# Altium schematic sheet Key.SchDoc
size A4
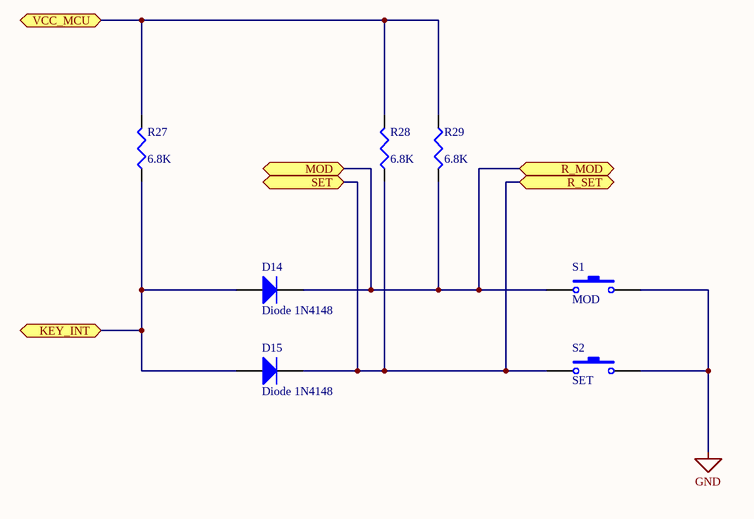
[diagram p0: Key.SchDoc]

## Parts
D14  Diode 1N4148  [DO-41]
D15  Diode 1N4148  [DO-41]
R27  value 6.8K  [12Z-2010]  (hidden comment: Res3)
R28  value 6.8K  [12Z-2010]  (hidden comment: Res3)
R29  value 6.8K  [12Z-2010]  (hidden comment: Res3)
S1  MOD  [SPST-2]
S2  SET  [SPST-2]

## Ports
KEY_INT (bidir), MOD (bidir), R_MOD (bidir), R_SET (bidir), SET (bidir), VCC_MCU (bidir)

## Nets
GND: S1.2 S2.2
KEY_INT: D14.1(A) D15.1(A) R27.1 ; port KEY_INT
MOD: D14.2(K) R29.2 S1.1 ; port MOD, port R_MOD
R_SET: D15.2(K) R28.1 S2.1 ; port SET, port R_SET
VCC_MCU: R27.2 R28.2 R29.1 ; port VCC_MCU

## Library data of the parts
D14 D15 = Diode 1N4005: 1 Amp General Purpose Rectifier; Published: 8-Jun-2000; LatestRevisionDate: 17-Jul-2002; LatestRevisionNote: Re-released for DXP Platform.; DatasheetVersion: 1998; PackageVersion: Aug-1999; PackageReference: DO-41; Publisher: Altium Limited; PackageDescription: Diode, Axial; Body 5.2 x 2.7 mm (LxDia. max), Lead Dia. 0.86 mm (max); Code_JEDEC: DO-204-AL; ComponentLink1Description: Manufacturer Link; ComponentLink1URL: http://www.fairchildsemi.com/; ComponentLink2Description: Datasheet; ComponentLink2URL: http://www.fairchildsemi.com/ds/1N%2F1N4001.pdf
R27-R29 = Res3: Resistor; Published: 8-Jun-2000; LatestRevisionDate: 29-May-2009; LatestRevisionNote: IPC-7351 Footprint Added.; PackageReference: J1-0603; Publisher: Altium Limited; PackageDescription: Chip Resistor
S1 S2 = SW-PB: Switch; Published: 24-Mar-1999; LatestRevisionDate: 17-Jul-2002; LatestRevisionNote: Re-released for DXP Platform.; PackageReference: SPST-2; Publisher: Altium Limited; PackageDescription: Switch; 2 Leads